# EAGLE design v1 (EAGLE 7.6.0)
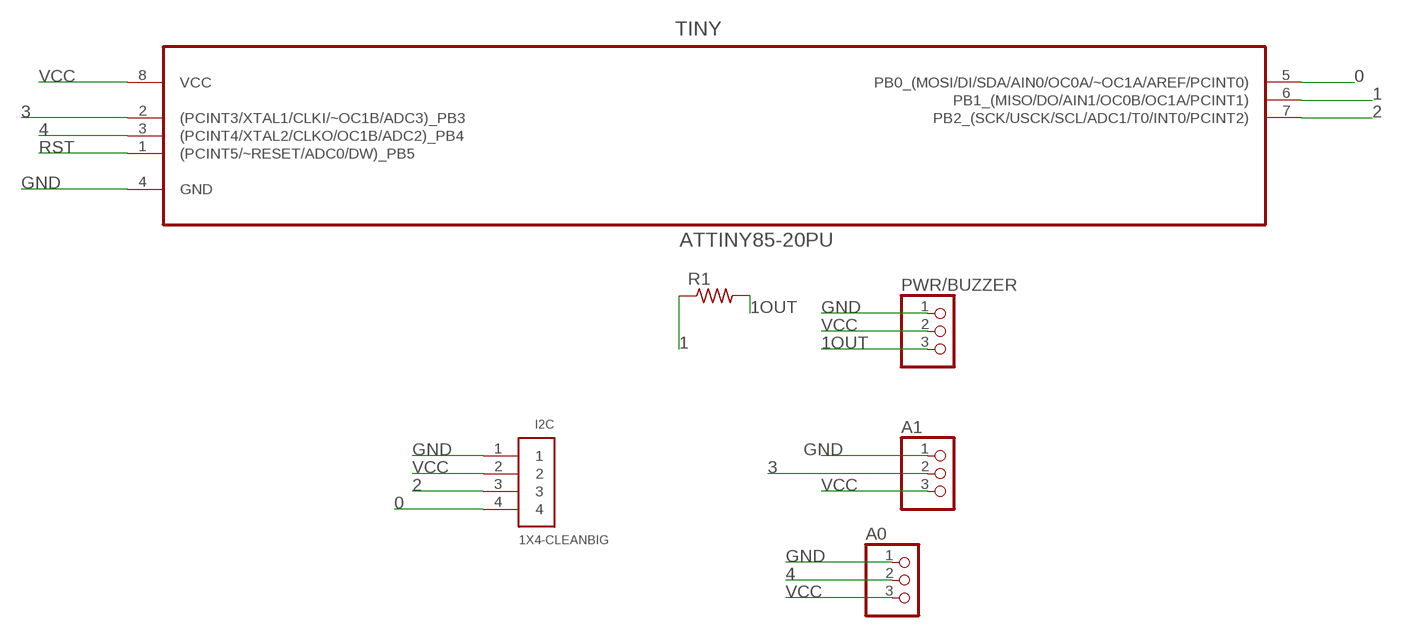
[diagram p0: schematic, sheet 1]

## Parts
A0  PINHD-1X3CB  [1X03-CLEANBIG]
A1  PINHD-1X3CB  [1X03-CLEANBIG]
I2C  1X4-CLEANBIG  [1X04-CLEANBIG]
PWR/BUZZER  PINHD-1X3CB  [1X03-CLEANBIG]
R1  R-US_0204/7  [0204/7]
TINY  ATTINY85-20PU  [DIP254P762X533-8]

## Nets
0: I2C.4 TINY.5(PB0_(MOSI/DI/SDA/AIN0/OC0A/~OC1A/AREF/PCINT0))
1: R1.1 TINY.6(PB1_(MISO/DO/AIN1/OC0B/OC1A/PCINT1))
1OUT: PWR/BUZZER.3 R1.2
2: I2C.3 TINY.7(PB2_(SCK/USCK/SCL/ADC1/T0/INT0/PCINT2))
3: A1.2 TINY.2((PCINT3/XTAL1/CLKI/~OC1B/ADC3)_PB3)
4: A0.2 TINY.3((PCINT4/XTAL2/CLKO/OC1B/ADC2)_PB4)
GND: A0.1 A1.1 I2C.1 PWR/BUZZER.1 TINY.4(GND)
RST: TINY.1((PCINT5/~RESET/ADC0/DW)_PB5)
VCC: A0.3 A1.3 I2C.2 PWR/BUZZER.2 TINY.8(VCC)

## Library data of the parts
A0 A1 PWR/BUZZER = adafruit:PINHD-1X3: PIN HEADER
I2C = adafruit:1X4: 4-pin connector
R1 = resistor:R-US_: RESISTOR, American symbol
TINY = Atmel_By_element14_Batch_1-00:ATTINY85-20PU: 8-bit Microcontroller with In-System Programmable Flash; MPN: ATTINY85-20PU; OC_FARNELL: 1455162; OC_NEWARK: 58M3796; PACKAGE: PDIP-8; SUPPLIER: Atmel

## Board
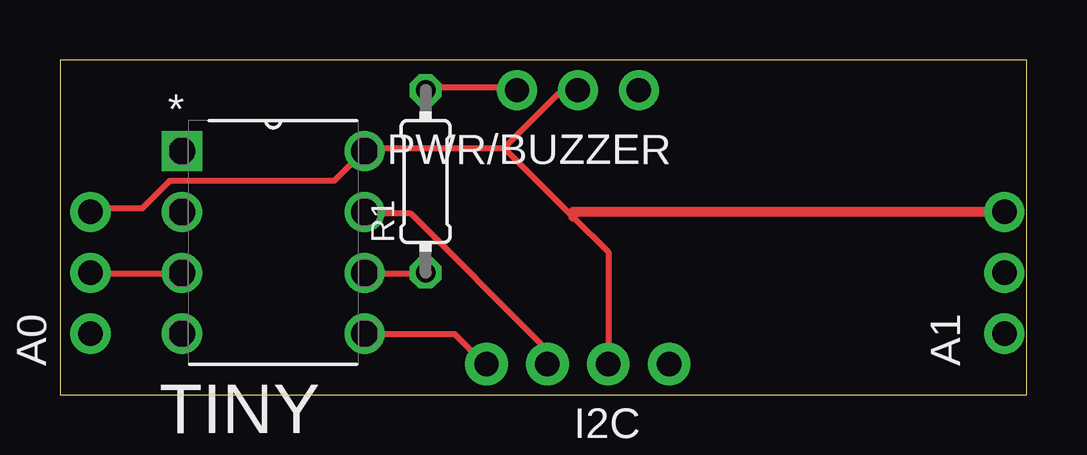
[diagram p1: board, top side]
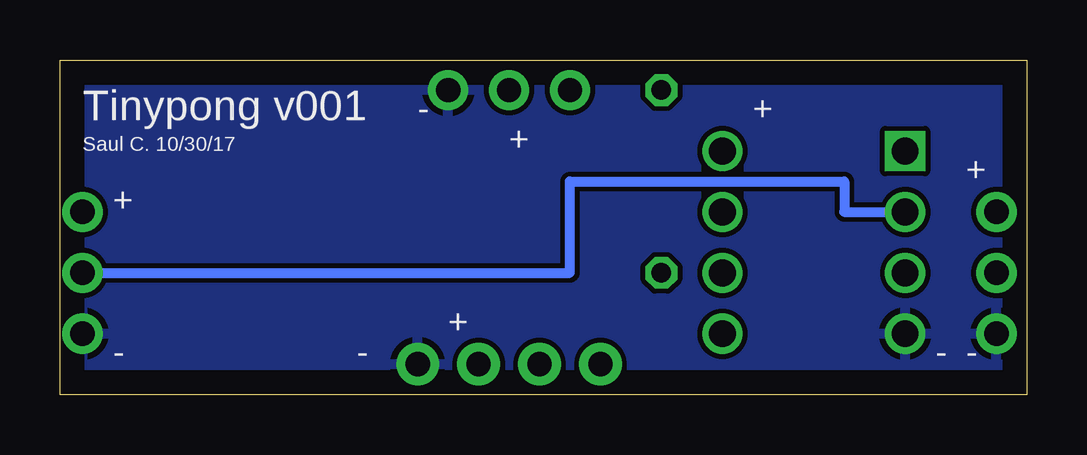
[diagram p2: board, bottom side, seen from below]

Size 40.31 x 13.96 mm. Coordinates in mm from the lower left corner, seen from the top.
Outline: 0,0 40.31,0 40.31,13.96 0,13.96 0,0
Copper layers (1*16): Top 0.035mm / dielectric 1.5mm / Bottom 0.035mm
Design rules "default": minimum track width 10mil, minimum drill 24mil, track to track 8mil, track to pad 8mil, pad to pad 8mil, via to via 8mil, smd to smd 8mil, copper to edge 40mil, drill to drill 8mil, minimum pad ring 10mil, minimum via ring 8mil, stop-mask expansion 4mil, vias tented up to drill 0mil, thermal gap 10mil

### Footprints (pad centres in the part's own frame; a part is rotated, then mirrored left to right if it is on the bottom)
1X03-CLEANBIG = drill 1.016 pad 1.676: 1 -2.54,0; 2 0,0; 3 2.54,0
1X04-CLEANBIG = drill 1.016 pad 1.778: 1 -3.81,0; 2 -1.27,0; 3 1.27,0; 4 3.81,0
0204/7 = drill 0.813 octagon: 1 -3.81,0; 2 3.81,0
DIP254P762X533-8 = drill 1.118 square: 1 -7.62,7.62 | drill 1.118: 2 -7.62,5.08; 3 -7.62,2.54; 4 -7.62,0; 5 0,0; 6 0,2.54; 7 0,5.08; 8 0,7.62

### Placement (x,y rotation side)
A0  1.27,5.08 90 top
A1  39.37,5.08 90 top
I2C  21.59,1.27 180 top
PWR/BUZZER  21.59,12.7 180 top
R1  15.24,8.89 90 top
TINY  12.7,2.54 0 top

### Tracks (layer width: path | path; a pad name or v marks a point on that pad's centre or on a via)
0
  Top 0.254: TINY.5 12.8,2.52 16.46,2.52 17.6,1.37 I2C.4
1
  Top 0.254: TINY.6 12.8,5.03 15.09,5.03 R1.1
1OUT
  Top 0.254: R1.2 15.32,12.8 18.97,12.8 PWR/BUZZER.3
2
  Top 0.254: TINY.7 12.8,7.54 14.63,7.54 20.12,2.06 20.12,1.37 I2C.3
3
  Bottom 0.406: A1.2 19.05,5.08 19.05,8.89 7.62,8.89 7.62,7.62 TINY.2
4
  Top 0.254: A0.2 1.37,5.03 5.03,5.03 TINY.3
GND
  pour Bottom: 0,0 0,13.97 40.64,13.97 40.64,0
VCC
  Top 0.254: A0.3 1.37,7.77 3.43,7.77 4.57,8.91 11.43,8.91 12.57,10.06 TINY.8 12.8,10.29 18.52,10.29 | 18.52,10.29 20.8,12.57 21.49,12.57 PWR/BUZZER.2 | I2C.2 22.86,5.94 21.39,7.42 18.52,10.29
  Top 0.406: A1.3 21.39,7.62 21.39,7.42

### Text on the board
bPlace: + | - | Tinypong v001 | + | Saul C. 10/30/17 | + | + | + | - | - | - | -